# EAGLE board GF130woBNC (EAGLE 9.5.2)
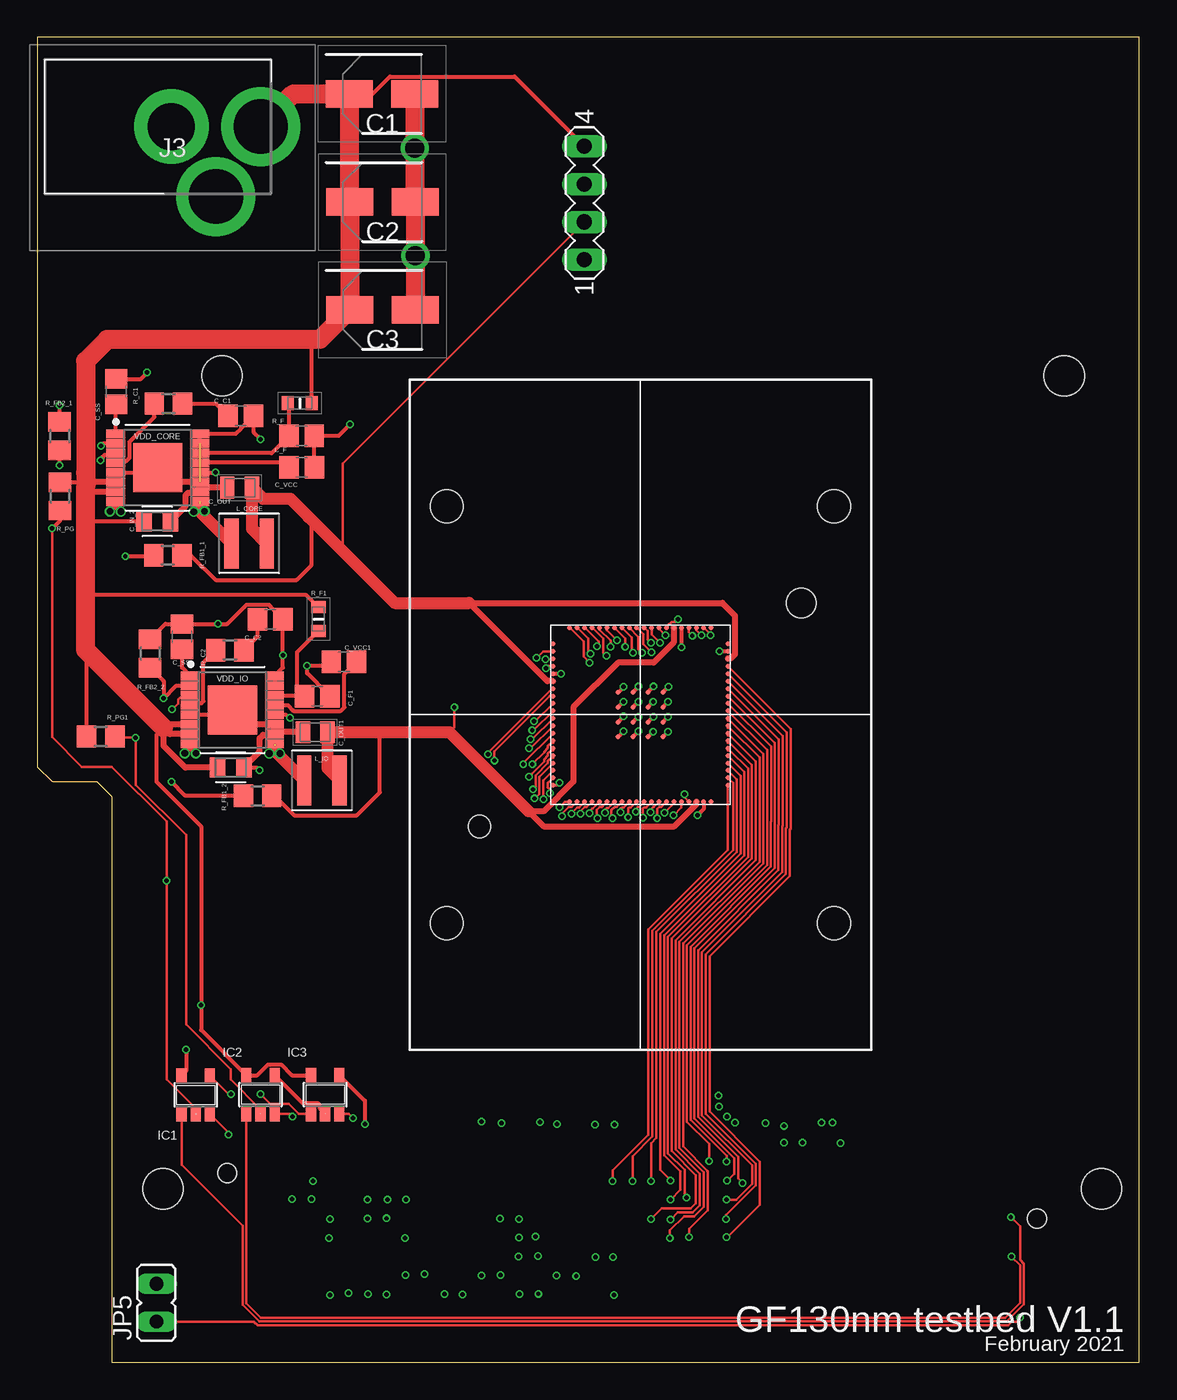
[diagram p3: board, top side]
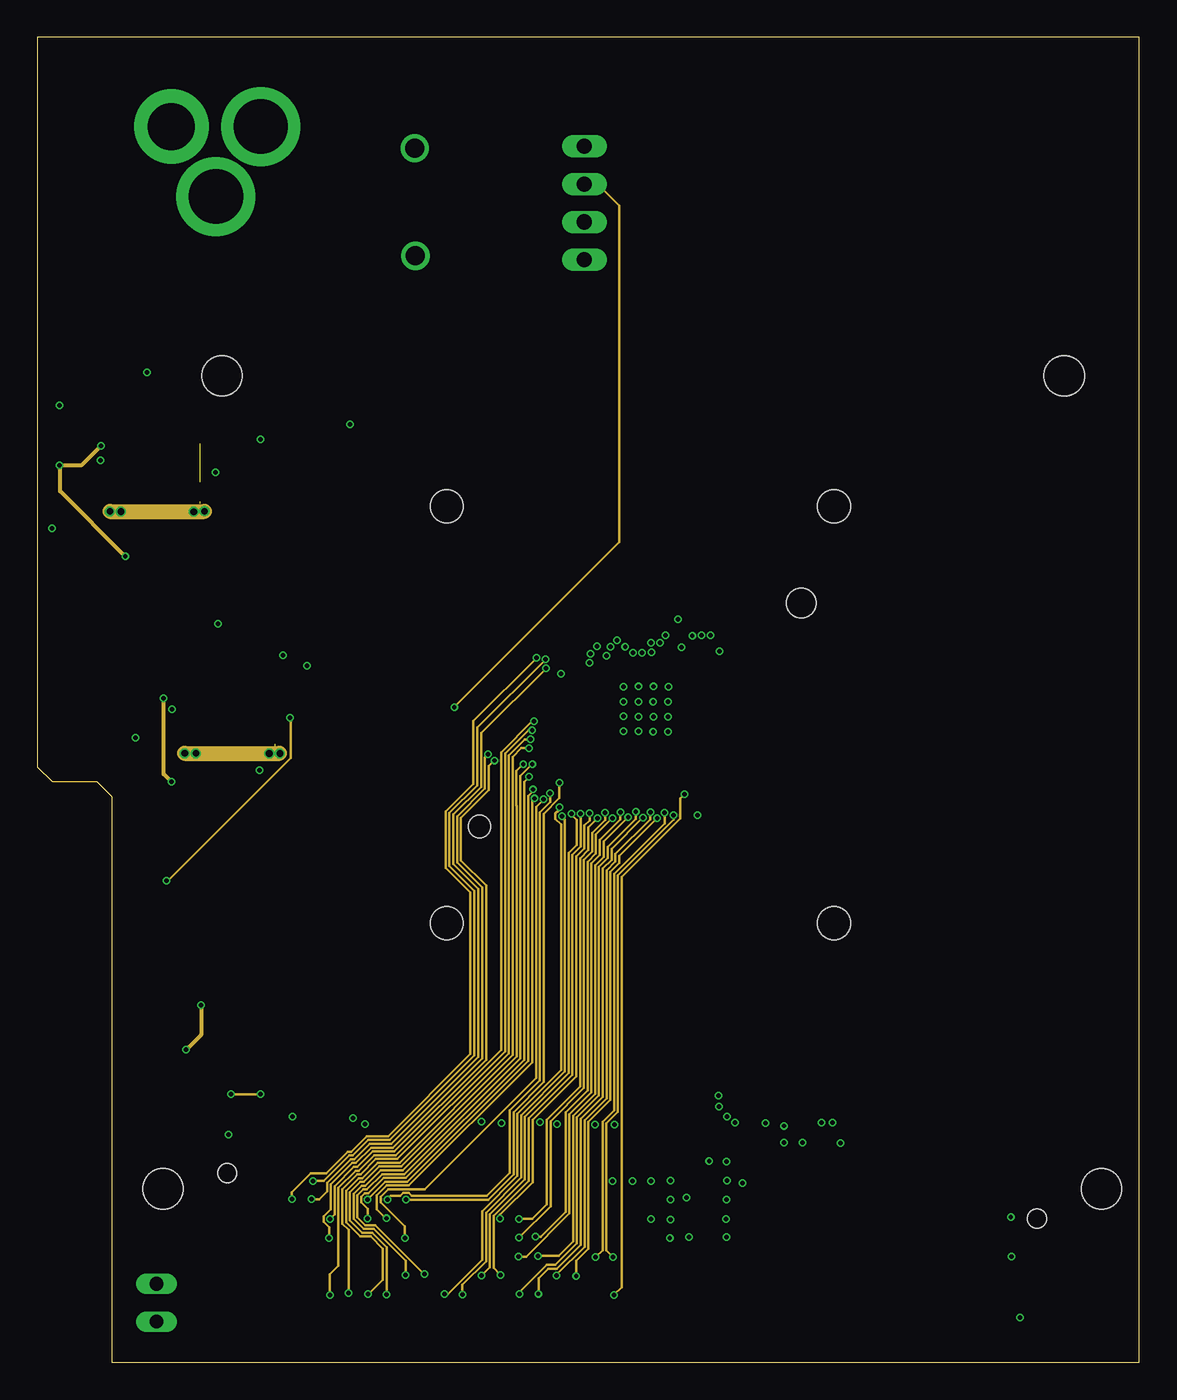
[diagram p4: board, inner layer Route2]
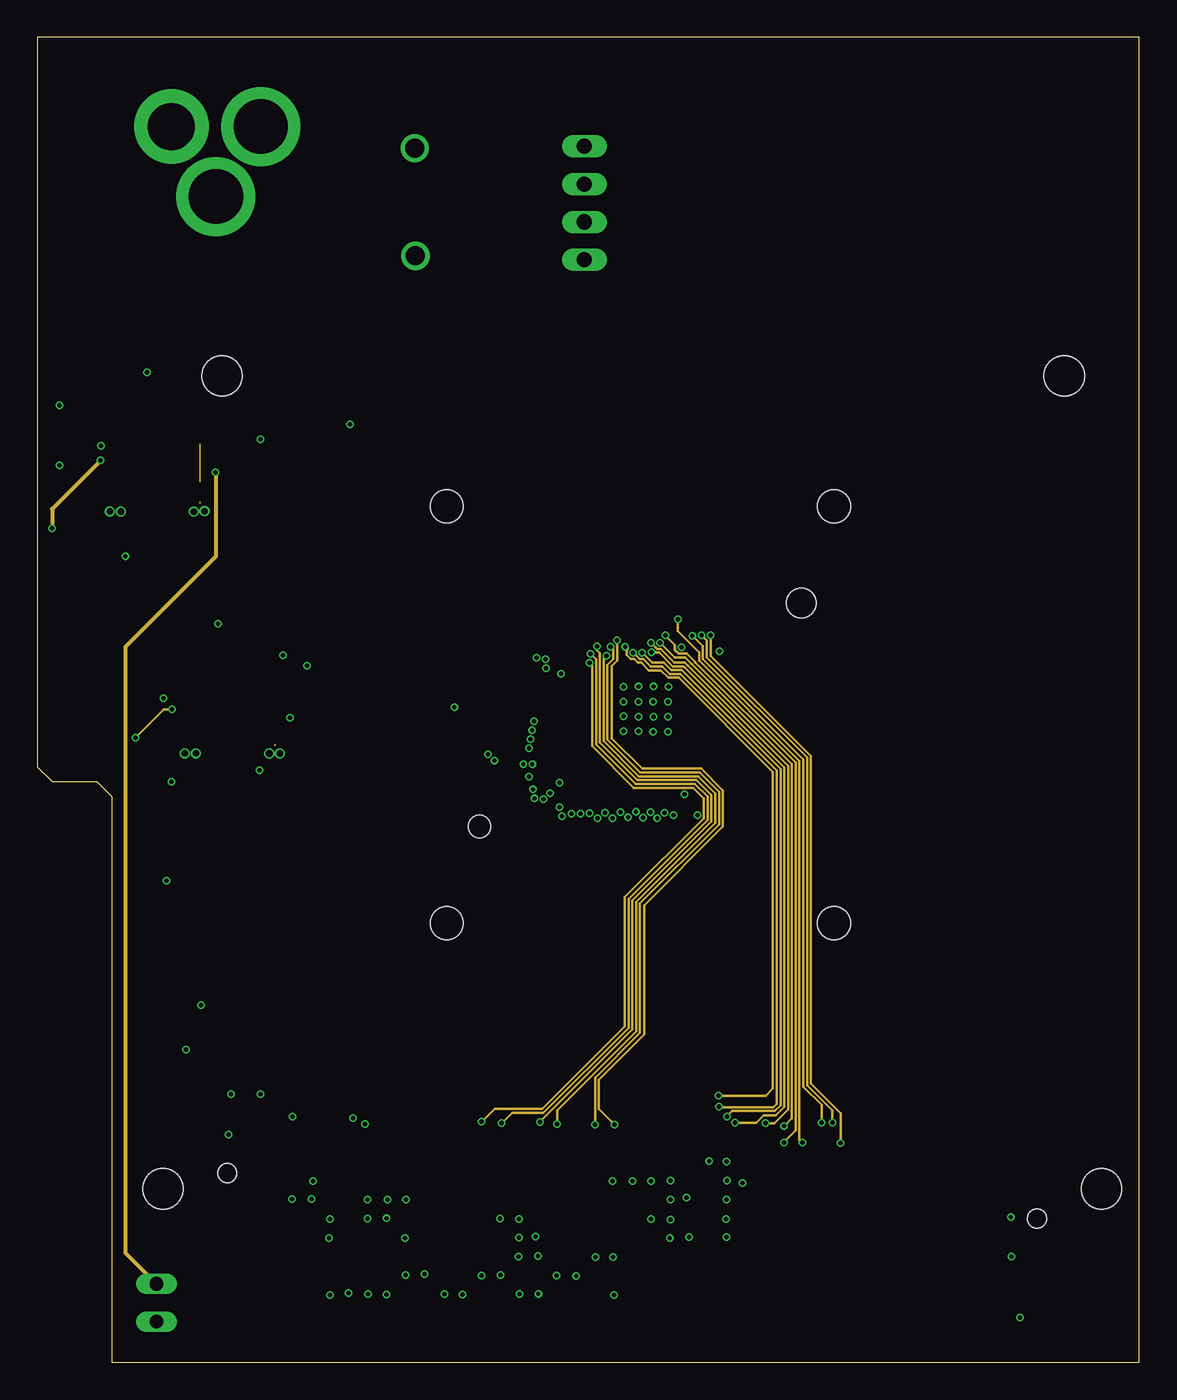
[diagram p5: board, inner layer Route15]
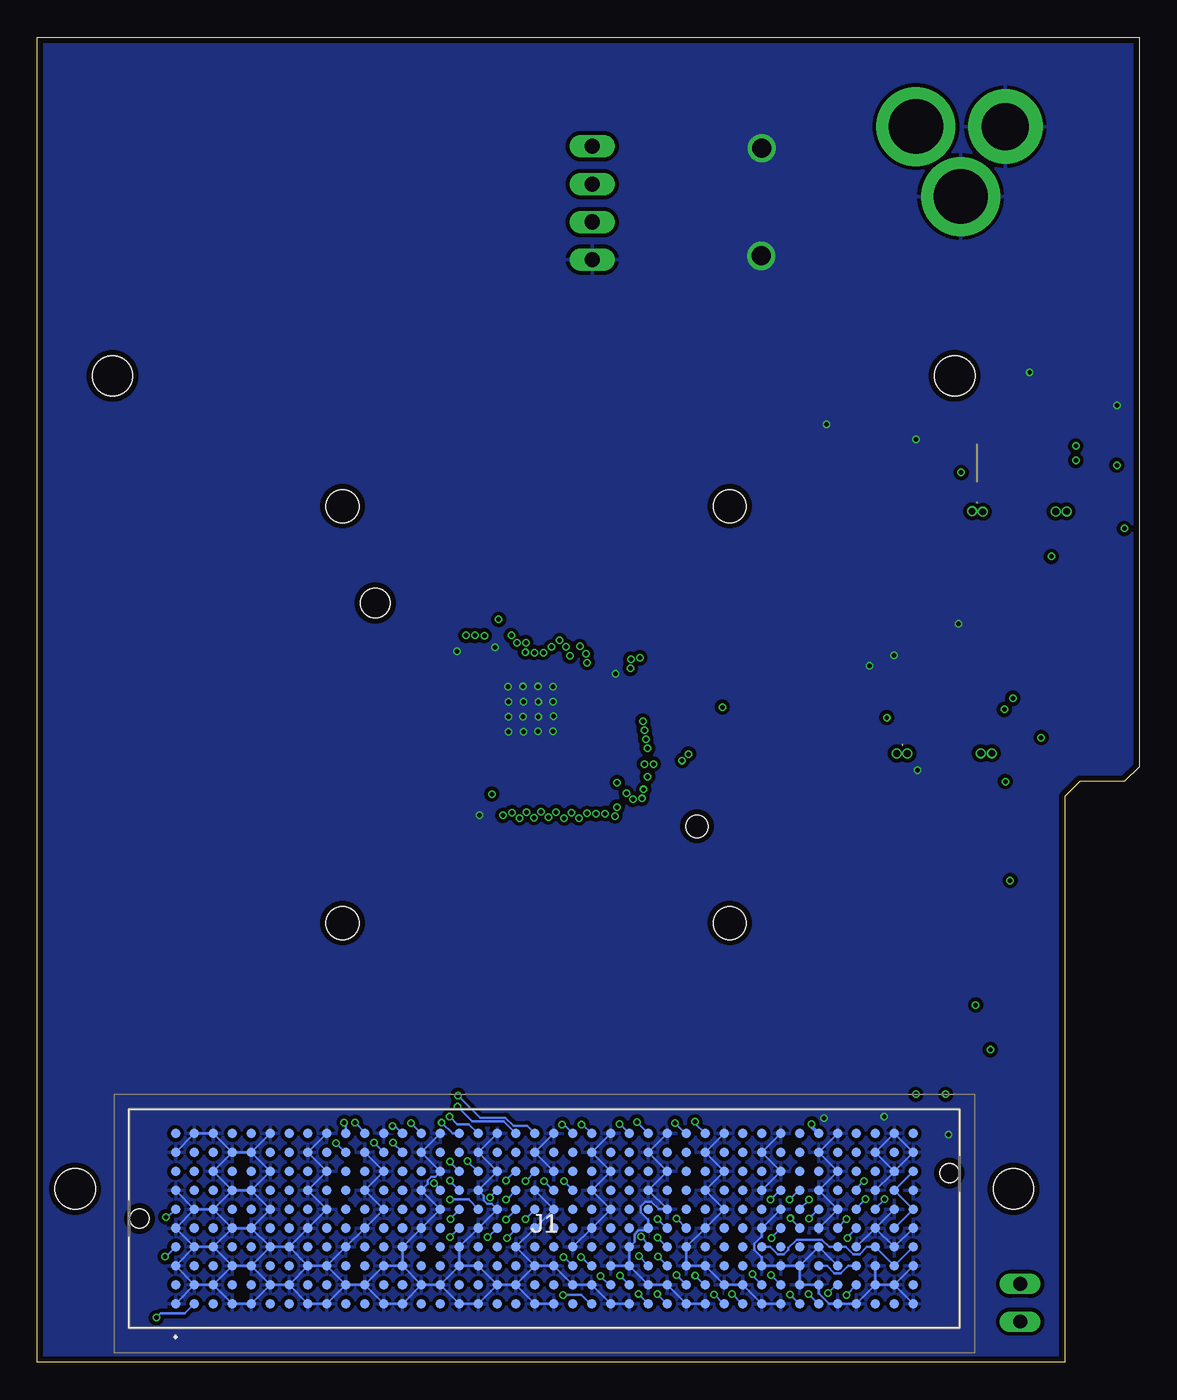
[diagram p6: board, bottom side, seen from below]

Size 74 x 89 mm. Coordinates in mm from the lower left corner, seen from the top.
Outline: 74,89 0,89 0,40 1,39 4,39 5,38 5,0 74,0 74,89
Copper layers (1*2+15*16): Top 0.0356mm / dielectric 0.1702mm / Route2 0.0178mm / dielectric 47mil / Route15 0.0178mm / dielectric 0.1702mm / Bottom 0.0356mm
Design rules "default *": minimum track width 4mil, minimum drill 0.3mm, track to track 4mil, track to pad 4mil, pad to pad 4mil, via to via 4mil, smd to smd 0mil, copper to edge 15mil, drill to drill 0mil, minimum pad ring 6mil, minimum via ring 4mil, stop-mask expansion 4mil, vias tented up to drill 0mil, thermal gap 10mil
Holes 2.7 mm at 8.45,11.65 71.45,11.65 12.4,66.25 68.95,66.25

## Footprints (pad centres in the part's own frame; a part is rotated, then mirrored left to right if it is on the bottom)
CAPAE530X610N = smd 3.15 x 1.85: 1 -2.2,0; 2 2.2,0
C0805 = smd 1.3 x 1.5: 1 -0.85,0; 2 0.85,0
CAPC2012X125N = smd 1.037 x 1.362: 1 -0.887,0; 2 0.887,0
CAPC2012X145N = smd 0.97 x 1.47: 1 -0.83,0; 2 0.83,0
SOT23-5 = smd 0.69 x 0.99: 1 -0.95,-1.29; 2 0,-1.29; 3 0.95,-1.29; 4 0.95,1.3; 5 -0.95,1.3
ASP13448801 = smd 0.64 x 0.64: A1 24.765,5.715; A2 23.495,5.715; A3 22.225,5.715; A4 20.955,5.715; A5 19.685,5.715; A6 18.415,5.715; A7 17.145,5.715; A8 15.875,5.715; A9 14.605,5.715; A10 13.335,5.715; A11 12.065,5.715; A12 10.795,5.715; A13 9.525,5.715; A14 8.255,5.715; A15 6.985,5.715; A16 5.715,5.715; A17 4.445,5.715; A18 3.175,5.715; A19 1.905,5.715; A20 0.635,5.715; A21 -0.635,5.715; A22 -1.905,5.715; A23 -3.175,5.715; A24 -4.445,5.715; A25 -5.715,5.715; A26 -6.985,5.715; A27 -8.255,5.715; A28 -9.525,5.715; A29 -10.795,5.715; A30 -12.065,5.715; A31 -13.335,5.715; A32 -14.605,5.715; A33 -15.875,5.715; A34 -17.145,5.715; A35 -18.415,5.715; A36 -19.685,5.715; A37 -20.955,5.715; A38 -22.225,5.715; A39 -23.495,5.715; A40 -24.765,5.715; B1 24.765,4.445; B2 23.495,4.445; B3 22.225,4.445; B4 20.955,4.445; B5 19.685,4.445; B6 18.415,4.445; B7 17.145,4.445; B8 15.875,4.445; B9 14.605,4.445; B10 13.335,4.445; B11 12.065,4.445; B12 10.795,4.445; B13 9.525,4.445; B14 8.255,4.445; B15 6.985,4.445; B16 5.715,4.445; B17 4.445,4.445; B18 3.175,4.445; B19 1.905,4.445; B20 0.635,4.445; B21 -0.635,4.445; B22 -1.905,4.445; B23 -3.175,4.445; B24 -4.445,4.445; B25 -5.715,4.445; B26 -6.985,4.445; B27 -8.255,4.445; B28 -9.525,4.445; B29 -10.795,4.445; B30 -12.065,4.445; B31 -13.335,4.445; B32 -14.605,4.445; B33 -15.875,4.445; B34 -17.145,4.445; B35 -18.415,4.445; B36 -19.685,4.445; B37 -20.955,4.445; B38 -22.225,4.445; B39 -23.495,4.445; B40 -24.765,4.445; C1 24.765,3.175; C2 23.495,3.175; C3 22.225,3.175; C4 20.955,3.175; C5 19.685,3.175; C6 18.415,3.175; C7 17.145,3.175; C8 15.875,3.175; C9 14.605,3.175; C10 13.335,3.175; C11 12.065,3.175; C12 10.795,3.175; C13 9.525,3.175; C14 8.255,3.175; C15 6.985,3.175; C16 5.715,3.175; C17 4.445,3.175; C18 3.175,3.175; C19 1.905,3.175; C20 0.635,3.175; C21 -0.635,3.175; C22 -1.905,3.175; C23 -3.175,3.175; C24 -4.445,3.175; C25 -5.715,3.175; C26 -6.985,3.175; C27 -8.255,3.175; C28 -9.525,3.175; C29 -10.795,3.175; C30 -12.065,3.175; C31 -13.335,3.175; C32 -14.605,3.175; C33 -15.875,3.175; C34 -17.145,3.175; C35 -18.415,3.175; C36 -19.685,3.175; C37 -20.955,3.175; C38 -22.225,3.175; C39 -23.495,3.175; C40 -24.765,3.175; D1 24.765,1.905; D2 23.495,1.905; D3 22.225,1.905; D4 20.955,1.905; D5 19.685,1.905; D6 18.415,1.905; D7 17.145,1.905; D8 15.875,1.905; D9 14.605,1.905; D10 13.335,1.905; D11 12.065,1.905; D12 10.795,1.905; D13 9.525,1.905; D14 8.255,1.905; D15 6.985,1.905; D16 5.715,1.905; D17 4.445,1.905; D18 3.175,1.905; D19 1.905,1.905; D20 0.635,1.905; D21 -0.635,1.905; D22 -1.905,1.905; D23 -3.175,1.905; D24 -4.445,1.905; D25 -5.715,1.905; D26 -6.985,1.905; D27 -8.255,1.905; D28 -9.525,1.905; D29 -10.795,1.905; D30 -12.065,1.905; D31 -13.335,1.905; D32 -14.605,1.905; D33 -15.875,1.905; D34 -17.145,1.905; D35 -18.415,1.905; D36 -19.685,1.905; D37 -20.955,1.905; D38 -22.225,1.905; D39 -23.495,1.905; D40 -24.765,1.905; E1 24.765,0.635; E2 23.495,0.635; E3 22.225,0.635; E4 20.955,0.635; E5 19.685,0.635; E6 18.415,0.635; E7 17.145,0.635; E8 15.875,0.635; E9 14.605,0.635; E10 13.335,0.635; E11 12.065,0.635; E12 10.795,0.635; E13 9.525,0.635; E14 8.255,0.635; E15 6.985,0.635; E16 5.715,0.635; E17 4.445,0.635; E18 3.175,0.635; E19 1.905,0.635; E20 0.635,0.635; E21 -0.635,0.635; E22 -1.905,0.635; E23 -3.175,0.635; E24 -4.445,0.635; E25 -5.715,0.635; E26 -6.985,0.635; E27 -8.255,0.635; E28 -9.525,0.635; E29 -10.795,0.635; E30 -12.065,0.635; E31 -13.335,0.635; E32 -14.605,0.635; E33 -15.875,0.635; E34 -17.145,0.635; E35 -18.415,0.635; E36 -19.685,0.635; E37 -20.955,0.635; E38 -22.225,0.635; E39 -23.495,0.635; E40 -24.765,0.635; F1 24.765,-0.635; F2 23.495,-0.635; F3 22.225,-0.635; F4 20.955,-0.635; F5 19.685,-0.635; F6 18.415,-0.635; F7 17.145,-0.635; F8 15.875,-0.635; F9 14.605,-0.635; F10 13.335,-0.635; F11 12.065,-0.635; F12 10.795,-0.635; F13 9.525,-0.635; F14 8.255,-0.635; F15 6.985,-0.635; F16 5.715,-0.635; F17 4.445,-0.635; F18 3.175,-0.635; F19 1.905,-0.635; F20 0.635,-0.635; F21 -0.635,-0.635; F22 -1.905,-0.635; F23 -3.175,-0.635; F24 -4.445,-0.635; F25 -5.715,-0.635; F26 -6.985,-0.635; F27 -8.255,-0.635; F28 -9.525,-0.635; F29 -10.795,-0.635; F30 -12.065,-0.635; F31 -13.335,-0.635; F32 -14.605,-0.635; F33 -15.875,-0.635; F34 -17.145,-0.635; F35 -18.415,-0.635; F36 -19.685,-0.635; F37 -20.955,-0.635; F38 -22.225,-0.635; F39 -23.495,-0.635; F40 -24.765,-0.635; G1 24.765,-1.905; G2 23.495,-1.905; G3 22.225,-1.905; G4 20.955,-1.905; G5 19.685,-1.905; G6 18.415,-1.905; G7 17.145,-1.905; G8 15.875,-1.905; G9 14.605,-1.905; G10 13.335,-1.905; G11 12.065,-1.905; G12 10.795,-1.905; G13 9.525,-1.905; G14 8.255,-1.905; G15 6.985,-1.905; G16 5.715,-1.905; G17 4.445,-1.905; G18 3.175,-1.905; G19 1.905,-1.905; G20 0.635,-1.905; G21 -0.635,-1.905; G22 -1.905,-1.905; G23 -3.175,-1.905; G24 -4.445,-1.905; G25 -5.715,-1.905; G26 -6.985,-1.905; G27 -8.255,-1.905; G28 -9.525,-1.905; G29 -10.795,-1.905; G30 -12.065,-1.905; G31 -13.335,-1.905; G32 -14.605,-1.905; G33 -15.875,-1.905; G34 -17.145,-1.905; G35 -18.415,-1.905; G36 -19.685,-1.905; G37 -20.955,-1.905; G38 -22.225,-1.905; G39 -23.495,-1.905; G40 -24.765,-1.905; H1 24.765,-3.175; H2 23.495,-3.175; H3 22.225,-3.175; H4 20.955,-3.175; H5 19.685,-3.175; H6 18.415,-3.175; H7 17.145,-3.175; H8 15.875,-3.175; H9 14.605,-3.175; H10 13.335,-3.175; H11 12.065,-3.175; H12 10.795,-3.175; H13 9.525,-3.175; H14 8.255,-3.175; H15 6.985,-3.175; H16 5.715,-3.175; H17 4.445,-3.175; H18 3.175,-3.175; H19 1.905,-3.175; H20 0.635,-3.175; H21 -0.635,-3.175; H22 -1.905,-3.175; H23 -3.175,-3.175; H24 -4.445,-3.175; H25 -5.715,-3.175; H26 -6.985,-3.175; H27 -8.255,-3.175; H28 -9.525,-3.175; H29 -10.795,-3.175; H30 -12.065,-3.175; H31 -13.335,-3.175; H32 -14.605,-3.175; H33 -15.875,-3.175; H34 -17.145,-3.175; H35 -18.415,-3.175; H36 -19.685,-3.175; H37 -20.955,-3.175; H38 -22.225,-3.175; H39 -23.495,-3.175; H40 -24.765,-3.175; J1 24.765,-4.445; J2 23.495,-4.445; J3 22.225,-4.445; J4 20.955,-4.445; J5 19.685,-4.445; J6 18.415,-4.445; J7 17.145,-4.445; J8 15.875,-4.445; J9 14.605,-4.445; J10 13.335,-4.445; J11 12.065,-4.445; J12 10.795,-4.445; J13 9.525,-4.445; J14 8.255,-4.445; J15 6.985,-4.445; J16 5.715,-4.445; J17 4.445,-4.445; J18 3.175,-4.445; J19 1.905,-4.445; J20 0.635,-4.445; J21 -0.635,-4.445; J22 -1.905,-4.445; J23 -3.175,-4.445; J24 -4.445,-4.445; J25 -5.715,-4.445; J26 -6.985,-4.445; J27 -8.255,-4.445; J28 -9.525,-4.445; J29 -10.795,-4.445; J30 -12.065,-4.445; J31 -13.335,-4.445; J32 -14.605,-4.445; J33 -15.875,-4.445; J34 -17.145,-4.445; J35 -18.415,-4.445; J36 -19.685,-4.445; J37 -20.955,-4.445; J38 -22.225,-4.445; J39 -23.495,-4.445; J40 -24.765,-4.445; K1 24.765,-5.715; K2 23.495,-5.715; K3 22.225,-5.715; K4 20.955,-5.715; K5 19.685,-5.715; K6 18.415,-5.715; K7 17.145,-5.715; K8 15.875,-5.715; K9 14.605,-5.715; K10 13.335,-5.715; K11 12.065,-5.715; K12 10.795,-5.715; K13 9.525,-5.715; K14 8.255,-5.715; K15 6.985,-5.715; K16 5.715,-5.715; K17 4.445,-5.715; K18 3.175,-5.715; K19 1.905,-5.715; K20 0.635,-5.715; K21 -0.635,-5.715; K22 -1.905,-5.715; K23 -3.175,-5.715; K24 -4.445,-5.715; K25 -5.715,-5.715; K26 -6.985,-5.715; K27 -8.255,-5.715; K28 -9.525,-5.715; K29 -10.795,-5.715; K30 -12.065,-5.715; K31 -13.335,-5.715; K32 -14.605,-5.715; K33 -15.875,-5.715; K34 -17.145,-5.715; K35 -18.415,-5.715; K36 -19.685,-5.715; K37 -20.955,-5.715; K38 -22.225,-5.715; K39 -23.495,-5.715; K40 -24.765,-5.715 | hole 1.27: 27.189,0; -27.191,-3.05
CONSOCJ2155 = drill 3.64 pad 5.3: 1 0,0; 3 -3,-4.7 | drill 3.162 pad 5: 2 -6,0
JP1 = drill 0.914 long: 1 0,-1.27; 2 0,1.27
INDDFN400X400X180-2N = smd 0.962 x 3.342: 1 -1.185,0; 2 1.185,0
R0805 = smd 1.3 x 1.5: 1 -0.95,0; 2 0.95,0
RESC1608X55N = smd 0.8 x 0.95: 1 -0.8,0; 2 0.8,0
MA04-1 = drill 1.016 long: 1 -3.81,0; 2 -1.27,0; 3 1.27,0; 4 3.81,0
GF130 = smd 0.34 x 0.34: P$1 9.64,-17.75; P$2 9.64,-18.25; P$3 9.64,-18.75; P$4 9.64,-19.25; P$5 9.64,-19.75; P$6 9.64,-20.25; P$7 9.64,-20.75; P$8 9.64,-21.25; P$9 9.64,-21.75; P$10 9.64,-22.25; P$11 9.64,-22.75; P$12 9.64,-23.25; P$13 9.64,-23.75; P$14 9.64,-24.25; P$15 9.64,-24.75; P$16 9.64,-25.25; P$17 9.64,-25.75; P$18 9.64,-26.25; P$19 9.64,-26.75; P$20 9.64,-27.25; P$21 10.75,-28.36; P$22 11.25,-28.36; P$23 11.75,-28.36; P$24 12.25,-28.36; P$25 12.75,-28.36; P$26 13.25,-28.36; P$27 13.75,-28.36; P$28 14.25,-28.36; P$29 14.75,-28.36; P$30 15.25,-28.36; P$31 15.75,-28.36; P$32 16.25,-28.36; P$33 16.75,-28.36; P$34 17.25,-28.36; P$35 17.75,-28.36; P$36 18.25,-28.36; P$37 18.75,-28.36; P$38 19.25,-28.36; P$39 19.75,-28.36; P$40 20.25,-28.36; P$41 21.37,-27.25; P$42 21.37,-26.75; P$43 21.37,-26.25; P$44 21.37,-25.75; P$45 21.37,-25.25; P$46 21.37,-24.75; P$47 21.37,-24.25; P$48 21.37,-23.75; P$49 21.37,-23.25; P$50 21.37,-22.75; P$51 21.37,-22.25; P$52 21.37,-21.75; P$53 21.37,-21.25; P$54 21.37,-20.75; P$55 21.37,-20.25; P$56 21.37,-19.75; P$57 21.37,-19.25; P$58 21.37,-18.75; P$59 21.37,-18.25; P$60 21.37,-17.75; P$61 20.25,-16.65; P$62 19.75,-16.65; P$63 19.25,-16.65; P$64 18.75,-16.65; P$65 18.25,-16.65; P$66 17.75,-16.65; P$67 17.25,-16.65; P$68 16.75,-16.65; P$69 16.25,-16.65; P$70 15.75,-16.65; P$71 15.25,-16.65; P$72 14.75,-16.65; P$73 14.25,-16.65; P$74 13.75,-16.65; P$75 13.25,-16.65; P$76 12.75,-16.65; P$77 12.25,-16.65; P$78 11.75,-16.65; P$79 11.25,-16.65; P$80 10.75,-16.65; P$81 16,-22; P$82 16,-23; P$83 15,-23; P$84 15,-22; P$85 15,-21; P$86 16,-21; P$87 17,-21; P$88 17,-22; P$89 17,-23; P$90 17,-24; P$91 16,-24; P$92 15,-24; P$93 14,-24; P$94 14,-23; P$95 14,-22; P$96 14,-21 | hole 1.5: 4.7,-30 | hole 2.2: 2.5,-36.5; 28.5,-36.5; 28.5,-8.5; 2.5,-8.5 | hole 2: 26.3,-15
SOP65P640X120-17T330L = smd 1.272 x 0.582: 1 -2.822,2.275; 2 -2.822,1.625; 3 -2.822,0.975; 4 -2.822,0.325; 5 -2.822,-0.325; 6 -2.822,-0.975; 7 -2.822,-1.625; 8 -2.822,-2.275; 9 2.822,-2.275; 10 2.822,-1.625; 11 2.822,-0.975; 12 2.822,-0.325; 13 2.822,0.325; 14 2.822,0.975; 15 2.822,1.625; 16 2.822,2.275 | smd 3.3 x 3.3: 17 0,0

## Placement (x,y rotation side)
C1  APXT160ARA101ME61G  [CAPAE530X610N]  23.15,85.2 0 top
C2  APXT160ARA101ME61G  [CAPAE530X610N]  23.17,77.93 0 top
C3  APXT160ARA101ME61G  [CAPAE530X610N]  23.18,70.69 0 top
C_C1  3.3nF  [C0805]  13.66,63.57 0 top
C_C2  3.3nF  [C0805]  15.65,49.91 0 top
C_F  1uF  [C0805]  17.75,62.23 0 top
C_F1  1uF  [C0805]  18.8,44.74 0 top
C_IN_1  GRM21BR60J226ME39L  [CAPC2012X125N]  12.99,39.95 0 top
C_IN_2  GRM21BR60J226ME39L  [CAPC2012X125N]  8.06,56.48 0 top
C_OUT  100uF  [CAPC2012X145N]  13.59,58.74 180 top
C_OUT1  100uF  [CAPC2012X145N]  18.66,42.32 180 top
C_SS  33nF  [C0805]  5.3,65.2 90 top
C_SS1  33nF  [C0805]  9.73,48.74 90 top
C_VCC  1uF  [C0805]  17.76,60.11 0 top
C_VCC1  1uF  [C0805]  20.59,47.06 180 top
IC1  74AHC1G08DBV  [SOT23-5]  10.64,17.96 0 top
IC2  74AHC1G08DBV  [SOT23-5]  14.99,17.98 0 top
IC3  74AHC1G08DBV  [SOT23-5]  19.33,17.98 0 top
J1  ASP-134488-01  [ASP13448801]  39.95,9.65 180 bottom
J3  CON-SOCJ-2155  [CONSOCJ2155]  15,83 0 top
JP5  1  [JP1]  8,4 0 top
L_CORE  KA5013-AEC  [INDDFN400X400X180-2N]  14.23,55 0 top
L_IO  KA5013-AEC  [INDDFN400X400X180-2N]  19.11,39.08 0 top
R_C1  4.87k  [R0805]  8.81,64.39 180 top
R_C2  6.81k  [R0805]  12.94,47.83 180 top
R_F  1  [RESC1608X55N]  17.63,64.42 0 top
R_F1  1  [RESC1608X55N]  18.88,49.92 90 top
R_FB1_1  4.99k  [R0805]  8.77,54.2 180 top
R_FB1_2  8.87k  [R0805]  14.8,38.05 180 top
R_FB2_1  10k  [R0805]  1.5,62.21 90 top
R_FB2_2  10.2k  [R0805]  7.58,47.61 90 top
R_PG  10K  [R0805]  1.53,58.16 90 top
R_PG1  10K  [R0805]  4.26,42.03 180 top
SV1  [MA04-1]  36.74,77.86 90 top
U$2  QFN80  [GF130]  25,66 0 top
VDD_CORE  LM20125/LM20125Q  [SOP65P640X120-17T330L]  8.08,60.09 0 top
VDD_IO  LM20125/LM20125Q  [SOP65P640X120-17T330L]  13.11,43.82 0 top

## Tracks (layer width: path | path; a pad name or v marks a point on that pad's centre or on a via)
3V3_CARRIER
  Bottom 0.152: J1.D40 J1.C39 J1.D38 18.29,7.75 18.79,7.25 19.2,7.25 19.7,7.75 J1.D36 20.83,7.75 21.33,8.24 23.01,8.24 23.58,7.68 23.58,7.54 23.87,7.25 24.28,7.25 24.78,7.75 J1.D32
5V_EXT  (via drill 0.3)
  Top 0.254: C1.1 22.53,85.2 23.68,86.35 32.06,86.35 SV1.4 | R_PG1.2 3.31,47.79 3.24,47.86 | R_F1.2 18.07,51.53 3.24,51.53 | C_IN_2.1 3.76,56.48 3.24,57 | R_PG.2 2.89,59.11 3.25,58.75 | R_F.2 18.43,68.14 18.98,68.69 | 8.48,42.62 8,42.14 8,39 11,36 v11,24 11,22.32 IC2.5 14.78,19.28 15.5,20 16.38,20 17.1,19.28 IC3.5 | v10,21 10,19.57 IC1.5
  Top 0.406: VDD_CORE.6 3.88,59.12 3.25,59.75 | VDD_CORE.7 3.54,58.47 3.25,58.75 3.24,58.76 | VDD_IO.7 8.9,42.2 8.48,42.62 | VDD_IO.6 8.71,42.84 8.48,42.62 | C_IN_1.1 9.94,39.95 8.48,41.41 8.48,42.62
  Top 1.27: 3.25,58.75 3.25,59.75 3.25,67.25 4.69,68.69 18.98,68.69 C3.1 C2.1 20.95,77.95 C1.1 17.2,85.2 J3.1 | 8.48,42.62 3.24,47.86 3.24,51.53 3.24,57 3.24,58.76
  Route2 0.254: v11,24 11,22 v10,21
12V_CARRIER
  Bottom 0.152: J1.C37 19.56,6.47 20.06,5.98 20.47,5.98 20.97,6.47 J1.C35
B48_L2_N  (via drill 0.3)
  Top 0.254: IC3.4 22,17.56 v22,16
  Bottom 0.254: v22,16 22,15.83 J1.K35
B48_L4_N  (via drill 0.3)
  Top 0.152: U$2.P$17 33.71,39.32 33.71,38.17 v33.41,37.87 v33.4,37.87
  Route2 0.152: v33.4,37.87 33.24,37.7 33.24,20.15 24.96,11.88 23.48,11.88 22.81,11.21 22.81,10.26 23.41,9.66 v23.43,9.66 v23.44,9.67
  Bottom 0.152: v23.44,9.67 22.8,9.04 J1.E34
B48_L4_P  (via drill 0.3)
  Top 0.152: U$2.P$18 33.98,39.09 33.98,37.83 v34.01,37.8
  Route2 0.152: v34.01,37.8 33.5,37.3 33.5,19.1 26.02,11.62 25.05,11.62 25.04,11.62 23.58,11.62 23.06,11.1 23.06,10.75 24.69,9.12 v24.69,8.34
  Bottom 0.152: J1.E33 24.69,8.4 v24.69,8.34
B48_L9_N  (via drill 0.3)
  Top 0.152: U$2.P$15 34.64,41.1 34.5,41.1 34.29,40.89 34.29,40.75 34.04,40.5 34.04,40.37 33.2,39.53 33.2,39.51 v33.03,39.33
  Route2 0.152: v33.03,39.33 32.69,38.99 32.69,20.33 24.75,12.38 23.27,12.38 22.23,11.35 22,11.35 21.75,11.1 21.75,10.74 22.19,10.3 v22.19,9.65
  Bottom 0.152: v22.19,9.65 21.55,10.29 J1.F35
B48_L9_P  (via drill 0.3)
  Top 0.152: U$2.P$16 34.64,40.6 34.5,40.6 34.29,40.39 34.29,40.26 33.46,39.42 33.46,38.65 v33.28,38.48
  Route2 0.152: v33.28,38.48 33.28,38.3 33.23,38.3 32.97,38.05 32.97,20.25 24.86,12.13 23.37,12.13 22.18,10.94 v22.18,10.92
  Bottom 0.152: v22.18,10.92 J1.F34
B48_L10_N  (via drill 0.3)
  Top 0.152: v30.27,40.85 30.27,40.95 34.57,45.25 U$2.P$7
  Route2 0.152: v30.27,40.85 30.06,40.64 30.06,38.55 28.19,36.67 28.19,33.59 29.87,31.9 29.87,20.42 23.87,14.42 22.43,14.42 21.39,13.38 21.16,13.38 19.72,11.94 19.72,10.28 19.24,9.8 19.24,9.44 19.61,9.07 19.61,8.32 v19.59,8.34
  Bottom 0.152: v19.59,8.34 19.59,8.42 J1.E37
B48_L10_P  (via drill 0.3)
  Top 0.152: v30.7,40.42 30.7,41.02 34.42,44.75 U$2.P$8
  Route2 0.152: v30.7,40.42 30.32,40.04 30.32,38.45 28.44,36.57 28.44,33.71 30.14,32.01 30.14,20.33 23.97,14.16 22.53,14.16 21.5,13.13 21.27,13.13 19.97,11.83 19.97,9.92 v19.67,9.62
  Bottom 0.152: v19.67,9.62 J1.E36
B48_L12_N  (via drill 0.3)
  Top 0.152: U$2.P$2 33.97,47.75 v33.53,47.32
  Route2 0.152: v33.53,47.32 29.29,43.08 29.29,38.86 27.42,36.99 27.42,33.22 29.09,31.55 29.09,20.72 23.55,15.18 22.11,15.18 21.07,14.14 20.84,14.14 19.4,12.7 18.38,12.7 17.1,11.42 v17.1,10.95
  Bottom 0.152: v17.1,10.95 17.73,10.32 J1.F38
B48_L12_P  (via drill 0.3)
  Top 0.152: U$2.P$4 34.31,46.75 v34.17,46.61
  Route2 0.152: v34.17,46.61 29.82,42.26 29.82,42.23 29.8,42.21 29.8,38.65 27.93,36.78 27.93,33.47 29.6,31.8 29.6,20.51 23.76,14.67 22.32,14.67 21.29,13.63 21.05,13.63 19.46,12.04 19.46,11.48 18.93,10.95 v18.4,10.95
  Bottom 0.152: v18.4,10.95 19,10.36 J1.F37
B64_L10_N  (via drill 0.3)
  Top 0.152: U$2.P$51 49.01,41.11 49.01,36.4 49,36.39 49,33.4 43.62,28.02 43.62,16.16 45.12,14.66 v45.12,13.51
  Bottom 0.152: v45.12,13.51 44.44,12.82 J1.H17
B64_L10_P  (via drill 0.3)
  Top 0.152: U$2.P$52 49.27,41.35 49.27,36.31 49.26,36.3 49.26,36.29 49.26,33.3 43.87,27.91 43.87,16.28 46.28,13.87 v46.28,13.49
  Bottom 0.152: v46.28,13.49 46.28,13.44 J1.H16
B64_L13_N  (via drill 0.3)
  Top 0.152: U$2.P$78 37.69,48.41 37.69,48.21 v37.57,48.09
  Route15 0.152: v37.57,48.09 37.57,47.84 37.78,47.63 37.78,41.61 40.29,39.1 44.26,39.1 45.26,38.09 45.26,36.32 39.96,31.02 39.96,22.35 v33.75,16.14 v33.74,16.14
  Bottom 0.152: v33.74,16.14 J1.K26
B64_L13_P  (via drill 0.3)
  Top 0.152: U$2.P$77 38,48.6 38,47.68 v38.23,47.45
  Route15 0.152: v38.23,47.45 38.03,47.25 38.03,41.72 40.4,39.35 44.38,39.35 45.52,38.21 45.52,36.22 40.22,30.91 40.22,22.24 34.9,16.92 v34.9,16.01
  Bottom 0.152: v34.9,16.01 34.26,15.37 J1.K25
B64_L15_N  (via drill 0.3)
  Top 0.152: U$2.P$44 47.23,39.39 47.23,34.17 41.84,28.78 41.84,12.91 v42.53,12.22
  Bottom 0.152: v42.53,12.22 41.92,12.82 J1.H19
B64_L15_P  (via drill 0.3)
  Top 0.152: U$2.P$43 46.97,39.14 46.97,34.29 41.58,28.9 41.58,15.06 41.21,14.7 41.22,14.7 v41.22,12.16
  Bottom 0.152: v41.22,12.16 40.59,12.79 J1.H20
B64_L16_N  (via drill 0.3)
  Top 0.152: U$2.P$53 49.53,41.59 49.53,36.53 49.52,36.52 49.52,36.2 49.52,36.19 49.51,36.18 49.51,33.19 44.13,27.8 44.13,16.38 46.8,13.71 46.8,12.67 46.32,12.19 v46.3,12.19
  Bottom 0.152: v46.3,12.19 J1.G16
B64_L16_P  (via drill 0.3)
  Top 0.152: U$2.P$54 49.8,41.82 49.8,36.19 49.78,36.17 49.78,36.1 49.77,36.09 49.77,36.08 49.77,33.07 44.38,27.68 44.38,16.49 47.05,13.81 47.05,12.35 v47.36,12.04
  Bottom 0.152: v47.36,12.04 46.94,11.62 J1.G15
B64_L19_N  (via drill 0.3)
  Top 0.152: v42.52,10.92 v42.53,10.92 43.18,11.57 43.18,12.82 42.09,13.91 42.09,28.67 47.48,34.05 47.48,39.64 U$2.P$45
  Bottom 0.152: v42.52,10.92 42.49,10.92 J1.G19
B64_L19_P  (via drill 0.3)
  Top 0.152: U$2.P$46 46.37,41.1 46.51,41.1 47.73,39.88 47.73,33.95 42.35,28.56 42.35,14.04 43.46,12.93 43.46,11.19 v43.59,11.06
  Bottom 0.152: v43.59,11.06 43.59,11.1 43.13,11.55 J1.G18
B65_L1_N  (via drill 0.3)
  Top 0.152: U$2.P$3 34.61,47.22 v34.14,47.22
  Route2 0.152: v34.14,47.22 29.55,42.62 29.55,38.75 27.68,36.89 27.68,33.32 29.34,31.66 29.34,20.61 23.66,14.93 22.22,14.93 21.18,13.89 20.95,13.89 19.24,12.18 v18.5,12.18
  Bottom 0.152: v18.5,12.18 19,11.69 J1.G37
B65_L6_N  (via drill 0.3)
  Top 0.152: U$2.P$27 38.35,37.24 38.24,37.24 38.12,37.12 v38.12,36.92
  Route2 0.152: v38.12,36.92 38.12,36.43 37.26,35.56 37.26,34.3 36.7,33.74 36.7,18.42 34.47,16.19 34.47,10.49 v32.36,8.38
  Bottom 0.152: v32.36,8.38 31.73,7.75 J1.D27
B65_L6_P  (via drill 0.3)
  Top 0.152: U$2.P$28 39.09,37.48 39.08,37.48 38.89,37.29 38.76,37.29 38.55,37.09 38.55,36.62 v38.62,36.56
  Route2 0.152: v38.62,36.56 37.51,35.45 37.51,34.17 36.95,33.62 36.95,18.25 35.48,16.77 35.48,10.11 33.8,8.43 v33.46,8.43
  Bottom 0.152: v33.46,8.43 32.97,7.93 J1.D26
B65_L9_N  (via drill 0.3)
  Top 0.152: U$2.P$41 46.37,34.42 41.03,29.08 41.03,15.27 38.64,12.88 v38.64,12.18
  Bottom 0.152: v38.64,12.18 38.05,11.59 J1.G22
B65_L9_P  (via drill 0.3)
  Top 0.152: v39.97,12.17 39.97,13.83 41.3,15.16 41.3,28.98 46.72,34.4 46.72,38.89 U$2.P$42
  Bottom 0.152: v39.97,12.17 39.35,11.55 J1.G21
B65_L10_N  (via drill 0.3)
  Top 0.152: U$2.P$29 39.38,37.27 39.27,37.27 39.16,37.16 v39.16,36.95
  Route2 0.152: v39.16,36.95 39.16,36.47 37.77,35.09 37.77,34.07 37.21,33.5 37.21,18.14 35.73,16.67 35.73,10 32.82,7.09 32.31,7.09 v32.31,7.11
  Bottom 0.152: v32.31,7.11 32.31,7.09 J1.C27
B65_L10_P  (via drill 0.3)
  Top 0.152: U$2.P$30 39.86,37.25 39.74,37.25 39.68,37.19 v39.68,36.62
  Route2 0.152: v39.68,36.62 38.04,34.98 38.04,33.96 37.46,33.38 37.46,18.04 35.98,16.56 35.98,8.11 35.02,7.15 v33.61,7.15 v33.61,7.14
  Bottom 0.152: v33.61,7.14 32.97,6.5 J1.C26
B65_L11_N  (via drill 0.3)
  Top 0.152: U$2.P$80 36.68,48.42 36.68,47.39 v37.08,46.99
  Route15 0.152: v37.08,46.99 37.27,46.8 37.27,41.38 40.06,38.59 44.04,38.59 44.76,37.88 44.76,36.54 39.45,31.24 39.45,22.56 33.91,17.02 30.71,17.02 v29.84,16.15
  Bottom 0.152: v29.84,16.15 29.84,16.05 J1.K29
B65_L11_P  (via drill 0.3)
  Top 0.152: U$2.P$79 37,48.6 37,47.74 v37.14,47.6
  Route15 0.152: v37.14,47.6 37.52,47.22 37.52,41.5 40.18,38.84 44.16,38.84 45.01,37.99 45.01,36.43 39.71,31.13 39.71,22.46 33.99,16.74 31.9,16.74 31.2,16.04 v31.18,16.07
  Bottom 0.152: v31.18,16.07 30.48,15.37 J1.K28
B65_L12_N  (via drill 0.3)
  Top 0.152: U$2.P$35 42.75,37.54 v42.12,36.92
  Route2 0.152: v42.12,36.92 42.12,36.2 38.73,32.81 38.73,16.92 37.96,16.14 37.96,7.54 37.5,7.08 v37.48,7.08
  Bottom 0.152: v37.48,7.08 36.88,6.47 J1.C23
B65_L12_P  (via drill 0.3)
  Top 0.152: U$2.P$36 43.25,37.26 v42.73,36.73
  Route2 0.152: v42.73,36.73 42.73,36.45 38.99,32.7 38.99,16.81 38.21,16.04 38.21,7.52 v38.65,7.08
  Bottom 0.152: v38.65,7.08 J1.C22
B65_L16_N  (via drill 0.3)
  Top 0.152: U$2.P$19 34.44,39.05 34.44,39.04 34.29,38.89 34.29,38.61 34.44,38.46 v34.44,38.23
  Route2 0.152: v34.44,38.23 34.44,37.63 33.76,36.95 33.76,18.93 31.73,16.91 31.73,12.72 30.18,11.17 25.13,11.17 24.94,11.37 24.58,11.37 24.39,11.17 23.74,11.17 v23.5,10.93
  Bottom 0.152: v23.5,10.93 22.88,11.55 J1.G34
B65_L16_P  (via drill 0.3)
  Top 0.152: U$2.P$20 34.88,38.75 v35.06,38.94
  Route2 0.152: v35.06,38.94 35.06,37.9 34.01,36.84 34.01,18.83 31.98,16.8 31.98,12.62 30.29,10.92 24.76,10.92 v24.76,10.94
  Bottom 0.152: v24.76,10.94 24.14,11.55 J1.G33
B65_L23_N  (via drill 0.3)
  Top 0.152: U$2.P$25 37.31,37.2 37.25,37.2 37.09,37.04 v37.09,36.87
  Route2 0.152: v37.09,36.87 37.09,36.39 36.74,36.04 36.74,34.51 36.19,33.97 36.19,19.21 33.26,16.28 33.26,12.09 31.07,9.9 v31.07,9.66
  Bottom 0.152: v31.07,9.66 J1.E28
B65_L23_P  (via drill 0.3)
  Top 0.152: U$2.P$26 37.97,37.36 37.96,37.36 37.89,37.29 37.76,37.29 37.57,37.1 37.57,36.62 v37.63,36.56
  Route2 0.152: v37.63,36.56 37,35.93 37,34.41 36.45,33.85 36.45,30 36.45,29.55 36.45,18.52 34.22,16.29 34.22,10.6 33.25,9.63 v32.36,9.63
  Bottom 0.152: v32.36,9.63 31.75,9.02 J1.E27
B66_L1_N  (via drill 0.3)
  Top 0.152: U$2.P$76 37.75,49.23 38.49,48.49 v38.49,48.07
  Route15 0.152: v38.49,48.07 38.66,47.9 38.66,47.22 38.29,46.85 38.29,41.82 40.49,39.62 44.48,39.62 45.78,38.32 45.78,36.12 40.47,30.81 40.47,22.12 37.45,19.1 v37.45,15.98
  Bottom 0.152: v37.45,15.98 37.39,15.98 J1.K23
B66_L1_P  (via drill 0.3)
  Top 0.152: U$2.P$75 38.25,49.17 v38.93,48.49
  Route15 0.152: v38.93,48.49 38.93,47.13 38.57,46.77 38.57,41.91 40.61,39.87 44.59,39.87 46.04,38.42 46.04,35.98 40.74,30.68 40.74,22.01 37.72,18.98 37.72,17.02 v38.76,15.97
  Bottom 0.152: v38.76,15.97 38.66,15.97 J1.K22
B66_L2_N  (via drill 0.3)
  Top 0.152: U$2.P$67 42.34,49.44 42.34,49.48 42.59,49.73 42.83,49.73 42.99,49.89 v43.02,49.89
  Route15 0.152: v43.02,49.89 43.02,49.1 44.44,47.68 44.44,47.12 51.18,40.38 51.18,14.91 51.33,14.76 v51.38,14.76
  Bottom 0.152: v51.38,14.76 51.38,14.73 J1.J12
B66_L2_P  (via drill 0.3)
  Top 0.152: U$2.P$68 41.75,49.24 v42.17,48.83
  Route15 0.152: v42.17,48.83 42.82,48.17 42.82,47.85 43.07,47.6 43.61,47.6 44.19,47.02 44.19,47.01 50.92,40.28 50.92,15.56 v50.12,14.76
  Bottom 0.152: v50.12,14.76 50.12,14.74 J1.J13
B66_L3_N  (via drill 0.3)
  Top 0.152: U$2.P$63 44.25,49.18 v44.6,48.83
  Route15 0.152: v44.6,48.83 44.78,48.65 44.95,48.48 44.95,47.46 44.96,47.45 44.96,47.34 51.69,40.62 51.69,18.61 53.39,16.91 v53.39,16.11
  Bottom 0.152: v53.39,16.11 53.28,16 J1.K10
B66_L3_P  (via drill 0.3)
  Top 0.152: U$2.P$64 43.75,49.04 v43.98,48.81
  Route15 0.152: v43.98,48.81 44.7,48.09 44.7,47.22 51.43,40.49 51.43,18.51 52.66,17.28 v52.66,16.1
  Bottom 0.152: v52.66,16.1 52.02,15.46 J1.K11
B66_L4_P  (via drill 0.3)
  Top 0.152: U$2.P$62 45.21,48.89 v45.21,48.83
  Route15 0.152: v45.21,48.83 45.21,48.21 45.22,48.2 45.22,47.44 51.94,40.72 51.94,18.72 53.94,16.72 v53.94,14.72
  Bottom 0.152: v53.94,14.72 53.31,14.1 J1.J10
B66_L8_N  (via drill 0.3)
  Top 0.152: U$2.P$55 50.07,42.05 50.07,36.03 50.03,35.99 50.03,35.98 50.02,35.97 50.02,32.93 44.63,27.55 44.63,16.59 48,13.23 48,12 46.92,10.92 v46.3,10.92 v46.29,10.93
  Bottom 0.152: v46.29,10.93 45.04,10.93 J1.F17
B66_L8_P  (via drill 0.3)
  Top 0.152: U$2.P$56 50.33,42.29 50.33,36.1 50.32,36.09 50.32,35.92 50.28,35.88 50.28,35.87 50.27,35.87 50.27,32.8 44.89,27.41 44.89,16.7 48.25,13.33 48.25,11.89 46.27,9.91 v46.27,9.63 v46.26,9.63
  Bottom 0.152: v46.26,9.63 45.66,10.22 J1.F16
B66_L14_N  (via drill 0.3)
  Top 0.152: U$2.P$72 40.37,48.73 40.37,47.92 v40.62,47.67
  Route15 0.152: v40.62,47.67 41.29,47 42.06,47 42.57,46.49 43.27,46.49 49.91,39.86 49.91,17.27 49.52,16.88 46.68,16.88 v46.31,16.51
  Bottom 0.152: v46.31,16.51 45.79,15.99 45.02,15.99 J1.K17
B66_L14_P  (via drill 0.3)
  Top 0.152: U$2.P$71 40.69,48.91 40.69,48.23 v41.23,47.69
  Route15 0.152: v41.23,47.69 41.48,47.69 41.52,47.66 41.77,47.66 42.67,46.75 43.39,46.75 43.43,46.71 43.43,46.7 50.16,39.96 50.16,17.16 49.59,16.59 48.77,16.59 48.27,16.09 v46.84,16.09
  Bottom 0.152: J1.K16 46.12,15.37 v46.84,16.09
B66_L15_N  (via drill 0.3)
  Top 0.152: U$2.P$49 46.37,42.6 46.51,42.6 48.5,40.62 48.5,33.62 43.11,28.24 43.11,14.4 44.74,12.76 44.74,10.45 44.12,9.82 43.44,9.82 42.47,8.85 v42.47,8.33
  Bottom 0.152: v42.47,8.33 41.85,8.95 J1.E19
B66_L15_P  (via drill 0.3)
  Top 0.152: U$2.P$50 46.37,43.1 46.51,43.1 48.75,40.86 48.75,33.52 43.36,28.13 43.36,14.5 45,12.87 45,12.83 45.01,12.82 45.01,10.22 43.77,8.97 v43.77,8.41
  Bottom 0.152: v43.77,8.41 43.73,8.41 J1.E18
B66_L17_N  (via drill 0.3)
  Top 0.152: U$2.P$70 41,49.1 41,48.54 v41.2,48.34
  Route15 0.152: v41.2,48.34 41.53,48 | 41.53,48 | 41.53,48 41.62,47.91 41.87,47.91 42.78,47 43.49,47 43.68,46.81 43.68,46.8 50.42,40.07 50.42,17 49.47,16.05 v48.89,16.05
  Bottom 0.152: v48.89,16.05 J1.K14
B66_L17_P  (via drill 0.3)
  Top 0.152: U$2.P$69 41.25,48.89 v41.8,48.34
  Route15 0.152: v41.8,48.34 42.81,47.33 43.52,47.33 43.93,46.92 43.93,46.91 50.67,40.17 50.67,16.37 50.16,15.86 v50.14,15.88
  Bottom 0.152: v50.14,15.88 49.99,15.88 J1.K13
B66_L18_N  (via drill 0.3)
  Top 0.152: U$2.P$74 39.48,48.62 v39.48,48.05
  Route15 0.152: v39.48,48.05 39.64,47.9 39.59,47.84 39.59,47.49 39.84,47.24 40.09,47.24 40.34,46.99 40.54,46.99 41.05,46.48 41.86,46.48 42.36,45.98 43.06,45.98 49.4,39.65 49.4,18.4 48.91,17.91 v45.75,17.91 v45.75,17.92
  Bottom 0.152: v45.75,17.92 44.26,16.43 42.56,16.43 42.02,15.89 41.11,15.89 J1.K20
B66_L18_P  (via drill 0.3)
  Top 0.152: U$2.P$73 39.91,48.69 39.91,47.77 v40.02,47.67
  Route15 0.152: v40.02,47.67 40.19,47.67 40.19,47.49 40.44,47.24 40.69,47.24 41.19,46.75 41.96,46.75 42.47,46.24 43.17,46.24 49.65,39.75 49.65,17.37 49.42,17.13 45.82,17.13 v45.78,17.17
  Bottom 0.152: v45.78,17.17 44.79,16.18 42.67,16.18 J1.K19
B66_L20_P  (via drill 0.3)
  Top 0.152: U$2.P$57 50.6,42.52 50.6,36.01 50.58,35.99 50.58,35.82 50.53,35.78 50.53,35.77 50.53,35.76 50.53,32.65 45.14,27.27 45.14,16.86 48.52,13.48 48.52,10.58 46.32,8.38 v46.29,8.41
  Bottom 0.152: v46.29,8.41 45.69,9.02 J1.E16
B66_L24_N  (via drill 0.3)
  Top 0.152: U$2.P$48 46.37,42.1 46.51,42.1 48.24,40.37 48.24,33.73 42.86,28.34 42.86,14.29 44.49,12.66 44.49,10.55 44.01,10.07 43.02,10.07 v42.53,9.58
  Bottom 0.152: v42.53,9.58 41.85,10.26 J1.F19
B66_L24_P  (via drill 0.3)
  Top 0.152: U$2.P$47 46.37,41.6 46.51,41.6 47.99,40.12 47.99,33.84 42.6,28.46 42.6,14.19 44.23,12.56 44.23,10.68 43.88,10.33 41.92,10.33 v41.21,9.62
  Bottom 0.152: v41.21,9.62 40.59,10.24 J1.F20
B228_RX1_P  (via drill 0.3)
  Top 0.152: v66,3 65.73,2.73 65.45,2.73 65.21,2.49 14.79,2.49 14.55,2.73 JP5.1
  Bottom 0.152: v66,3 65.72,3.28 64.1,3.28 J1.A2
B228_TX1_N  (via drill 0.3)
  Top 0.152: U$2.P$37 43.47,37.92 v43.47,38.16
  Route2 0.152: v43.47,38.16 43.18,37.87 43.18,36.54 39.24,32.6 39.24,5.05 v38.72,4.53 v38.71,4.53
  Bottom 0.152: v38.71,4.53 37.46,4.53 36.87,3.94 J1.A23
B228_TX2_N  (via drill 0.3)
  Top 0.152: U$2.P$31 40.41,37.3 40.4,37.3 40.39,37.29 40.32,37.29 40.19,37.16 v40.19,36.97
  Route2 0.152: v40.19,36.97 40.19,36.5 38.31,34.62 38.31,33.86 37.72,33.27 37.72,17.93 36.24,16.46 36.24,8.01 34.77,6.54 34.22,6.54 32.37,4.7 v32.37,4.58
  Bottom 0.152: v32.37,4.58 31.73,3.94 J1.A27
B228_TX2_P  (via drill 0.3)
  Top 0.152: U$2.P$32 40.88,37.27 40.74,37.27 40.66,37.19 v40.66,36.59
  Route2 0.152: v40.66,36.59 38.56,34.49 38.56,33.75 37.97,33.16 37.97,17.83 36.49,16.35 36.49,7.9 34.88,6.29 34.32,6.29 33.66,5.63 33.66,4.6 v33.64,4.6
  Bottom 0.152: v33.64,4.6 J1.A26
B228_TX3_N  (via drill 0.3)
  Top 0.152: U$2.P$21 35.43,37.64 v35.07,37.29
  Route2 0.152: v35.07,37.29 35.07,37.11 35.04,37.11 34.79,36.86 34.79,36.5 35.18,36.12 35.18,19.63 32.24,16.7 32.24,12.51 29.88,10.15 29.88,6.9 27.55,4.57 27.36,4.57 v27.35,4.58 v27.35,4.59
  Bottom 0.152: v27.35,4.59 26.7,3.94 J1.A31
B228_TX3_P  (via drill 0.3)
  Top 0.152: v35.22,36.68 35.22,36.82 35.69,37.29 35.9,37.29 U$2.P$22
  Route2 0.152: v35.22,36.68 35.43,36.47 35.43,19.53 32.49,16.59 32.49,12.41 30.13,10.05 30.13,6.79 28.55,5.21 v28.55,4.56
  Bottom 0.152: v28.55,4.56 27.93,3.94 J1.A30
B229_TX0_N  (via drill 0.3)
  Top 0.152: U$2.P$11 33.24,41.85 v33.13,41.85
  Route2 0.152: v33.13,41.85 v33.13,41.84 32.74,41.84 31.67,40.77 31.67,20.74 24.33,13.4 22.85,13.4 21.81,12.37 21.58,12.37 20.73,11.52 20.73,9.42 21.7,8.45 22.38,8.45 23.21,7.63 23.21,5.55 22.23,4.57 v22.21,4.58
  Bottom 0.152: v22.21,4.58 21.57,3.94 J1.A35
B229_TX0_P  (via drill 0.3)
  Top 0.152: U$2.P$12 33.13,41.24 v33.03,41.24
  Route2 0.152: v33.03,41.24 32.51,41.24 31.92,40.66 31.92,20.64 24.43,13.15 22.95,13.15 21.92,12.11 21.69,12.11 20.99,11.41 20.99,9.52 21.81,8.7 22.49,8.7 23.46,7.73 v23.46,4.56
  Bottom 0.152: v23.46,4.56 22.84,3.94 J1.A34
B229_TX2_N  (via drill 0.3)
  Top 0.152: U$2.P$9 33.45,43.06 v33.34,43.06
  Route2 0.152: v33.34,43.06 33.23,43.06 31.15,40.98 31.15,20.98 24.08,13.91 22.64,13.91 21.6,12.87 21.37,12.87 20.23,11.73 20.23,6.5 19.66,5.92 v19.66,4.53
  Bottom 0.152: J1.B37 19.66,4.54 v19.66,4.53
B229_TX2_P  (via drill 0.3)
  Top 0.152: U$2.P$10 33.34,42.45 v33.24,42.45
  Route2 0.152: v33.24,42.45 32.99,42.45 31.41,40.88 31.41,20.89 24.18,13.65 22.74,13.65 21.71,12.62 21.48,12.62 20.48,11.62 20.48,9.31 20.9,8.89 v20.9,4.66
  Bottom 0.152: v20.9,4.66 20.36,5.21 J1.B36
B229_TX3_N  (via drill 0.3)
  Top 0.152: U$2.P$13 32.63,40.24 v32.63,40.17
  Route2 0.152: v32.63,40.17 32.18,39.72 32.18,37.38 32.18,20.53 24.54,12.89 23.06,12.89 22.02,11.86 21.79,11.86 21.24,11.31 21.24,9.63 21.91,8.96 22.59,8.96 24.74,6.81 v24.74,5.86
  Bottom 0.152: v24.74,5.86 J1.B33
B229_TX3_P  (via drill 0.3)
  Top 0.152: U$2.P$14 34.64,41.6 34.5,41.6 34.29,41.39 34.29,41.25 34.04,41 34.04,40.97 v33.24,40.17
  Route2 0.152: v33.24,40.17 32.43,39.37 32.43,37.49 32.43,20.43 24.64,12.64 23.16,12.64 22.13,11.6 21.9,11.6 21.5,11.2 21.5,9.73 22.02,9.21 22.7,9.21 v25.99,5.92
  Bottom 0.152: v25.99,5.92 25.99,5.85 J1.B32
B230_TX0_N  (via drill 0.3)
  Top 0.152: U$2.P$23 36.38,37.27 36.27,37.27 35.88,36.88 v35.88,36.85
  Route2 0.152: v35.88,36.85 35.88,36.76 36.23,36.41 36.23,34.75 35.68,34.2 35.68,19.42 32.75,16.48 32.75,12.3 30.39,9.94 30.39,6.38 v29.82,5.81
  Bottom 0.152: v29.82,5.81 29.21,5.21 J1.B29
B230_TX0_P  (via drill 0.3)
  Top 0.152: U$2.P$24 36.91,37.3 36.9,37.3 36.89,37.29 36.76,37.29 36.48,37.02 v36.48,36.84
  Route2 0.152: v36.48,36.84 36.48,34.63 35.94,34.08 35.94,19.32 33,16.38 33,12.2 30.64,9.84 30.64,6.34 31.07,5.91 31.07,5.87 v31.09,5.87
  Bottom 0.152: v31.09,5.87 J1.B28
B230_TX1_N  (via drill 0.3)
  Top 0.152: U$2.P$33 41.4,37.29 41.36,37.29 41.16,37.09 v41.16,36.94
  Route2 0.152: v41.16,36.94 41.16,36.47 38.82,34.13 38.82,33.63 38.22,33.03 38.22,17.72 36.75,16.25 36.75,7.77 34.88,5.9 v34.88,5.84
  Bottom 0.152: v34.88,5.84 34.24,5.21 J1.B25
B230_TX1_P  (via drill 0.3)
  Top 0.152: U$2.P$34 42.12,37.51 42.1,37.51 42.1,37.5 41.89,37.29 41.76,37.29 41.63,37.16 v41.63,36.56
  Route2 0.152: v41.63,36.56 39.08,34.01 39.08,33.53 38.48,32.93 38.48,17.62 37,16.14 37,7.62 36.19,6.81 v36.19,5.79
  Bottom 0.152: v36.19,5.79 35.6,5.21 J1.B24
FB  (via drill 0.3)
  Top 0.254: R_FB1_2.2 9.95,38.05 v9,39 | VDD_IO.2 9.34,45.45 v8.49,44.6 8.49,45.75 R_FB2_2.1
  Route2 0.254: v9,39 8.49,39.51 v8.49,44.6
GND  (via drill 0.3, 1.27)  (1 unrouted)
  Top 0.152: IC1.3 12.85,15.41 12.85,15.28 v12.83,15.28 | IC2.3 16.94,16.69 v17.12,16.51 v17.13,16.51 | IC3.3 20.91,16.69 v21.19,16.41
  Top 0.254: VDD_IO.5 12.79,43.49 VDD_IO.17 | R_FB2_2.2 8.61,49.59 C_SS1.2 v12.13,49.59 12.76,49.59 14.05,50.89 15.54,50.89 15.68,50.76 15.68,50.73 C_C2.2 v16.49,47.49 v16.5,47.48 16.5,46.66 VDD_IO.16 VDD_IO.15 | C_F1.2 18.83,45.56 18.83,45.59 18.12,46.29 v18.12,46.77 19.45,46.77 C_VCC1.2 | C_IN_1.2 14.73,39.95 v14.9,39.78 v14.91,39.78 | VDD_CORE.5 7.75,59.77 VDD_CORE.17 | C_SS.2 6.95,66.05 v7.37,66.47 v7.36,66.48 | C_VCC.2 C_F.2 20.23,62.23 v21,63 v21,63.01 | VDD_CORE.15 VDD_CORE.16 13.33,62.37 13.69,62.73 13.69,62.75 C_C1.2 14.51,62.49 v15,62 v14.99,61.99 | U$2.P$59 v45.81,47.75 | U$2.P$65 v43.25,48.03 | U$2.P$5 v35.16,46.25 | U$2.P$39 44.75,37.16 v44.32,36.73 | U$2.P$96 v39.37,45.37 v39.37,45.38 | U$2.P$85 v40.38,45.38 v40.38,45.39 | U$2.P$86 v41.38,45.39 | U$2.P$87 42.37,45.37 v42.4,45.37 | U$2.P$95 v39.36,44.36 v39.36,44.37 | U$2.P$84 v40.36,44.36 v40.36,44.37 | U$2.P$81 41,44.02 v41.36,44.38 | U$2.P$88 v42.36,44.36 v42.36,44.37 | U$2.P$94 39.35,43.35 v39.35,43.38 | U$2.P$83 v40.36,43.36 v40.36,43.37 | U$2.P$82 v41.37,43.37 v41.38,43.37 | U$2.P$89 v42.36,43.36 | U$2.P$93 v39.37,42.37 | U$2.P$92 v40.37,42.37 | U$2.P$91 v41.36,42.36 | U$2.P$90 v42.36,42.36 | R_FB2_1.2 v1.5,64.26
  Top 0.406: C_OUT1.2 16.46,42.32 VDD_IO.11 | VDD_IO.11 VDD_IO.10 15.88,42.14 15.17,42.14 14.94,41.91 14.94,41.01 C_IN_1.2 | VDD_IO.11 14.09,42.84 VDD_IO.17 | C_OUT.2 11.18,58.74 VDD_CORE.10 | VDD_CORE.10 VDD_CORE.11 9.05,59.12 VDD_CORE.17 | C_IN_2.2 9.96,57.49 9.96,58.23 10.14,58.41 10.85,58.41 VDD_CORE.10
  Top 1.27: C1.2 v25.35,81.55 25.35,77.95 C2.2 C3.2
  Bottom 0.152: J1.A1 J1.B2 | J1.B2 J1.C1 J1.D2 | J1.D2 J1.E1 J1.F2 | J1.F2 J1.G1 | J1.J1 J1.K2 J1.K3 J1.J4 | J1.J4 J1.H3 J1.G4 | J1.G4 J1.F3 | J1.F3 J1.F2 | J1.F3 J1.E4 | J1.E4 J1.D3 | J1.D3 J1.D2 | J1.K6 J1.J5 | J1.J5 J1.J4 | J1.J5 J1.H6 J1.G5 | J1.G5 J1.G4 | J1.G5 J1.F6 J1.E5 | J1.E5 J1.E4 | J1.E5 J1.D6 | J1.D6 J1.D7 | J1.D7 J1.E8 J1.F9 J1.G8 J1.H9 J1.J8 J1.K9 | J1.D3 J1.C4 | J1.C4 J1.B3 | J1.B3 J1.B2 | J1.B3 J1.A4 J1.A5 J1.B6 | J1.B6 J1.C5 | J1.C5 J1.C4 | J1.C5 J1.D6 | J1.D7 J1.C8 | J1.C8 J1.B7 | J1.B7 J1.B6 | J1.B7 J1.A8 J1.A9 J1.B10 | J1.B10 J1.C9 | J1.C9 J1.C8 | J1.C9 J1.D10 J1.E11 J1.F12 J1.G11 J1.H12 J1.J11 | J1.B10 J1.B11 51.91,5.09 | 51.91,5.09 J1.A12 J1.A13 J1.B14 | J1.B14 J1.C13 | J1.C13 J1.C12 51.91,5.32 51.91,5.09 | J1.C13 J1.D13 J1.E14 J1.F15 J1.G14 47.79,11.97 47.79,12.22 47.54,12.47 47.29,12.47 J1.H15 J1.J14 J1.K15 | J1.B14 J1.B15 46.87,5.13 | 46.87,5.13 J1.A16 J1.A17 J1.B18 | J1.B18 J1.C17 J1.C16 | J1.C16 46.87,5.28 46.87,5.13 | J1.C16 J1.D16 J1.E17 J1.F18 43.47,10.63 43.77,10.63 44.02,10.88 44.02,11.18 J1.G17 J1.H18 J1.J17 J1.K18 | J1.K21 J1.J20 J1.H21 | J1.G20 J1.F21 J1.E20 J1.D19 J1.C20 | J1.C20 J1.B19 | J1.B19 J1.B18 | J1.B19 J1.A20 J1.A21 | J1.C20 J1.C21 J1.B22 J1.B23 J1.A24 J1.A25 | J1.D22 J1.E23 J1.F24 J1.G23 J1.H24 J1.J23 J1.K24 | J1.K27 J1.J26 J1.H27 J1.G26 J1.F27 | J1.F27 | J1.K30 J1.J29 J1.H30 J1.G29 J1.F30 J1.E29 J1.D28 J1.C28 J1.C29 J1.B30 J1.B31 J1.A32 J1.A33 | J1.C25 J1.D25 33.89,8.09 33.89,8.61 33.64,8.86 33.12,8.86 J1.E26 32.97,9.58 33.46,10.08 33.46,10.49 33.17,10.78 32.76,10.78 32.27,10.29 J1.F27 | J1.C25 J1.C24 | J1.C25 J1.B26 J1.B27 J1.A28 J1.A29 | J1.C34 J1.B34 J1.B35 21.54,4.64 20.82,3.94 J1.A36 J1.A37 J1.B38 | J1.B38 J1.C38
  Bottom 0.152: J1.C34 J1.D35 J1.C36 | J1.C34 J1.C33 J1.C32 25.34,7.04 25.84,7.54 25.84,7.95 25.34,8.45 J1.E32 J1.F33 | J1.A40 J1.B39 | J1.B39 J1.B38 | J1.E38 J1.D39 J1.E40 | J1.E38 J1.D37 | J1.E38 J1.F39 | J1.E35 J1.F36 J1.G35 J1.H36 J1.J35 J1.K36 | J1.G38 16.64,12.64 | 16.64,12.64 J1.H39 | J1.H39 J1.J38 J1.K39 J1.J40 J1.H39 | 16.27,12.64 16.64,12.64 | J1.K33 J1.J32 J1.H33 J1.G32 | J1.B39 J1.C40
  other vias: 25.39,74.32
  pour Bottom (isolate 0.254): 5,0 5,38 4,39 1,39 0,40 0,89.04 74,89.04 74,0
N$1
  Top 0.254: VDD_IO.4 10.42,44.28 11.02,44.28 11.15,44.41 11.15,46.99 R_C2.2
N$2
  Top 0.254: VDD_CORE.1 5.26,64.31 C_SS.1
N$3
  Top 0.254: VDD_CORE.4 5.39,60.55 5.99,60.55 6.2,60.76 6.2,61.84 7.86,63.49 R_C1.2
N$4
  Top 0.254: R_C1.1 11.99,64.39 C_C1.1
N$5
  Top 0.254: VDD_CORE.13 16.61,60.41 C_VCC.1
N$6
  Top 0.254: R_C2.1 14.8,48.74 C_C2.1
N$7  (via drill 0.45)  (1 unrouted)
  Top 0.406: v4.88,57.15 5.05,57.32 5.05,57.6 VDD_CORE.8 5.45,57.62 5.45,57.31 v5.62,57.14 | v11.23,57.16 11.08,57.31 11.08,57.81 VDD_CORE.9 10.68,57.81 10.68,57.3 v10.51,57.13
  Top 0.813: L_CORE.1 10.9,57.14 10.9,57.67
  Route2 0.406: v11.22,57.15 v11.23,57.16
  Route2 1.016: v4.88,57.15 v11.22,57.15
N$8
  Top 0.254: C_VCC1.1 20.62,46.24 20.62,43.98 20.39,43.76 17.2,43.76 16.82,44.15 VDD_IO.13
N$9
  Top 0.254: VDD_IO.1 9.73,46.65 C_SS1.1
N$10  (via drill 0.45)  (1 unrouted)
  Top 0.406: v10.65,40.9 v10.64,40.9 10.49,41.05 10.49,41.34 VDD_IO.8 10.29,41.29 v9.9,40.9 | v15.58,40.89 15.73,41.05 15.73,41.34 VDD_IO.9 16.13,41.34 16.13,41.05 v16.29,40.89
  Top 0.813: L_IO.1 15.93,41.07 15.93,41.4
  Route2 0.406: v16.28,40.9 v16.29,40.89
  Route2 1.016: v9.9,40.9 v16.28,40.9
N$11
  Top 0.254: VDD_IO.14 17.89,44.8 C_F1.1 17.43,45.26 17.43,47.67 R_F1.1
N$12
  Top 0.254: R_F.1 16.9,64.35 C_F.1 15.73,61.06 VDD_CORE.14
N$13  (via drill 0.3)
  Top 0.254: VDD_CORE.2 4.43,61.72 v4.27,61.55 | v1.51,60.25 R_FB2_1.1 | R_FB1_1.2 7.75,54.13 v5.92,54.13 v5.91,54.12
  Route2 0.254: v4.27,61.55 2.95,60.23 1.53,60.23 | 1.53,60.23 v1.51,60.25 | v5.91,54.12 1.53,58.5 1.53,60.23
N$15  (via drill 0.3)
  Top 0.152: IC3.1 17.56,16.69 16.88,17.36 15.64,17.36 v15,18 | v13,18 12.85,18 IC1.4
  Route2 0.152: v15,18 v13,18
N$16
  Top 0.254: IC2.4 17.81,17.41 18.82,17.41 18.95,17.28 18.95,17.07 IC3.2
PG_C2M  (via drill 0.3)
  Top 0.152: IC2.1 14.04,3.96 15,3 65,3 66,4 66,6.51 v65.41,7.1
  Bottom 0.152: v65.41,7.1 65.36,7.1 J1.D1
PG_CORE  (via drill 0.3)
  Top 0.152: IC1.2 10.64,17.05 8.68,19.01 v8.68,32.36 8.68,36.32 5,40 3,40 1,42 v1,56
  Top 0.254: VDD_IO.12 16.68,43.49 16.88,43.3 v16.96,43.3 | VDD_CORE.3 5.13,60.93 4.53,60.93 4.39,60.8 4.39,60.68 4.29,60.58 v4.26,60.58 | v1,56 1.53,56.53 R_PG.1
  Route2 0.152: v16.96,43.3 17.02,43.24 17.02,40.59 8.73,32.31
  Route2 0.254: 8.73,32.31 v8.68,32.36
  Route15 0.254: v4.26,60.58 1,57.32 v1,56
PG_IO  (via drill 0.3)
  Top 0.152: VDD_IO.3 10.11,44.61 9.58,44.61 9.47,44.51 9.47,44.27 v9.06,43.85 | IC2.2 14.99,17 12.99,19 12.99,19.69 9.99,22.69 9.99,35.4 6.6,38.79 v6.6,41.96 5.28,41.96 R_PG1.1
  Route15 0.152: v9.06,43.85 8.49,43.85 v6.6,41.96
PG_M2C  (via drill 0.3)
  Top 0.152: IC1.1 9.69,13.25 13.79,9.15 13.79,3.85 14.89,2.75 65.11,2.75 66.25,3.9 66.25,6.62 66,6.87 66,9.12 v65.36,9.76 v65.36,9.77
  Bottom 0.152: v65.36,9.77 65.23,9.77 J1.F1
PWR_EN  (via drill 0.3)
  Top 0.254: VDD_CORE.12 v11.96,59.77 v11.97,59.77
  Route15 0.254: v11.97,59.77 11.97,54.11 5.91,48.05 5.91,7.36 JP5.2
VADJ
  Bottom 0.152: J1.H40 J1.G39 J1.F40 J1.E39
VDD_CORE
  Top 0.152: SV1.2 20.5,60.35 20.5,54.5 | 29.39,51 29,51
  Top 0.254: R_FB1_1.1 10.32,54.2 11.97,52.55 17.41,52.55 18.42,53.56 18.42,56.58 18.23,56.77
  Top 0.406: U$2.P$6 34.25,45.75 29,51 46,51 46.84,50.16 46.84,47.55 46.57,47.27 46.4,47.27 U$2.P$58
  Top 0.813: 29,51 24,51 20.5,54.5 18.23,56.77 17,58 15.16,58 C_OUT.1 14.42,55.99 L_CORE.2
VDD_IO  (via drill 0.3)
  Top 0.152: v28,44 28,42.64 27.68,42.32
  Top 0.254: R_FB1_2.1 15.95,38.05 17.27,36.73 21.45,36.73 23,38.28 23,42.32
  Top 0.406: U$2.P$66 42.73,49.33 42.73,48.34 41.38,47 39,47 36,44 36,39 34,37 33,37 34,36 42.78,36 44.23,37.44 44.23,37.62 U$2.P$38
  Top 0.813: L_IO.2 19.49,39.88 C_OUT1.1 23,42.32 27.68,42.32 33,37
  Route2 0.152: SV1.3 37.64,79.13 39.09,77.68 39.09,55.09 v28,44

## Text on the board
tNames: GF130nm testbed V1.1 | February 2021